# EAGLE design 14226^6 (EAGLE 7.6.0)
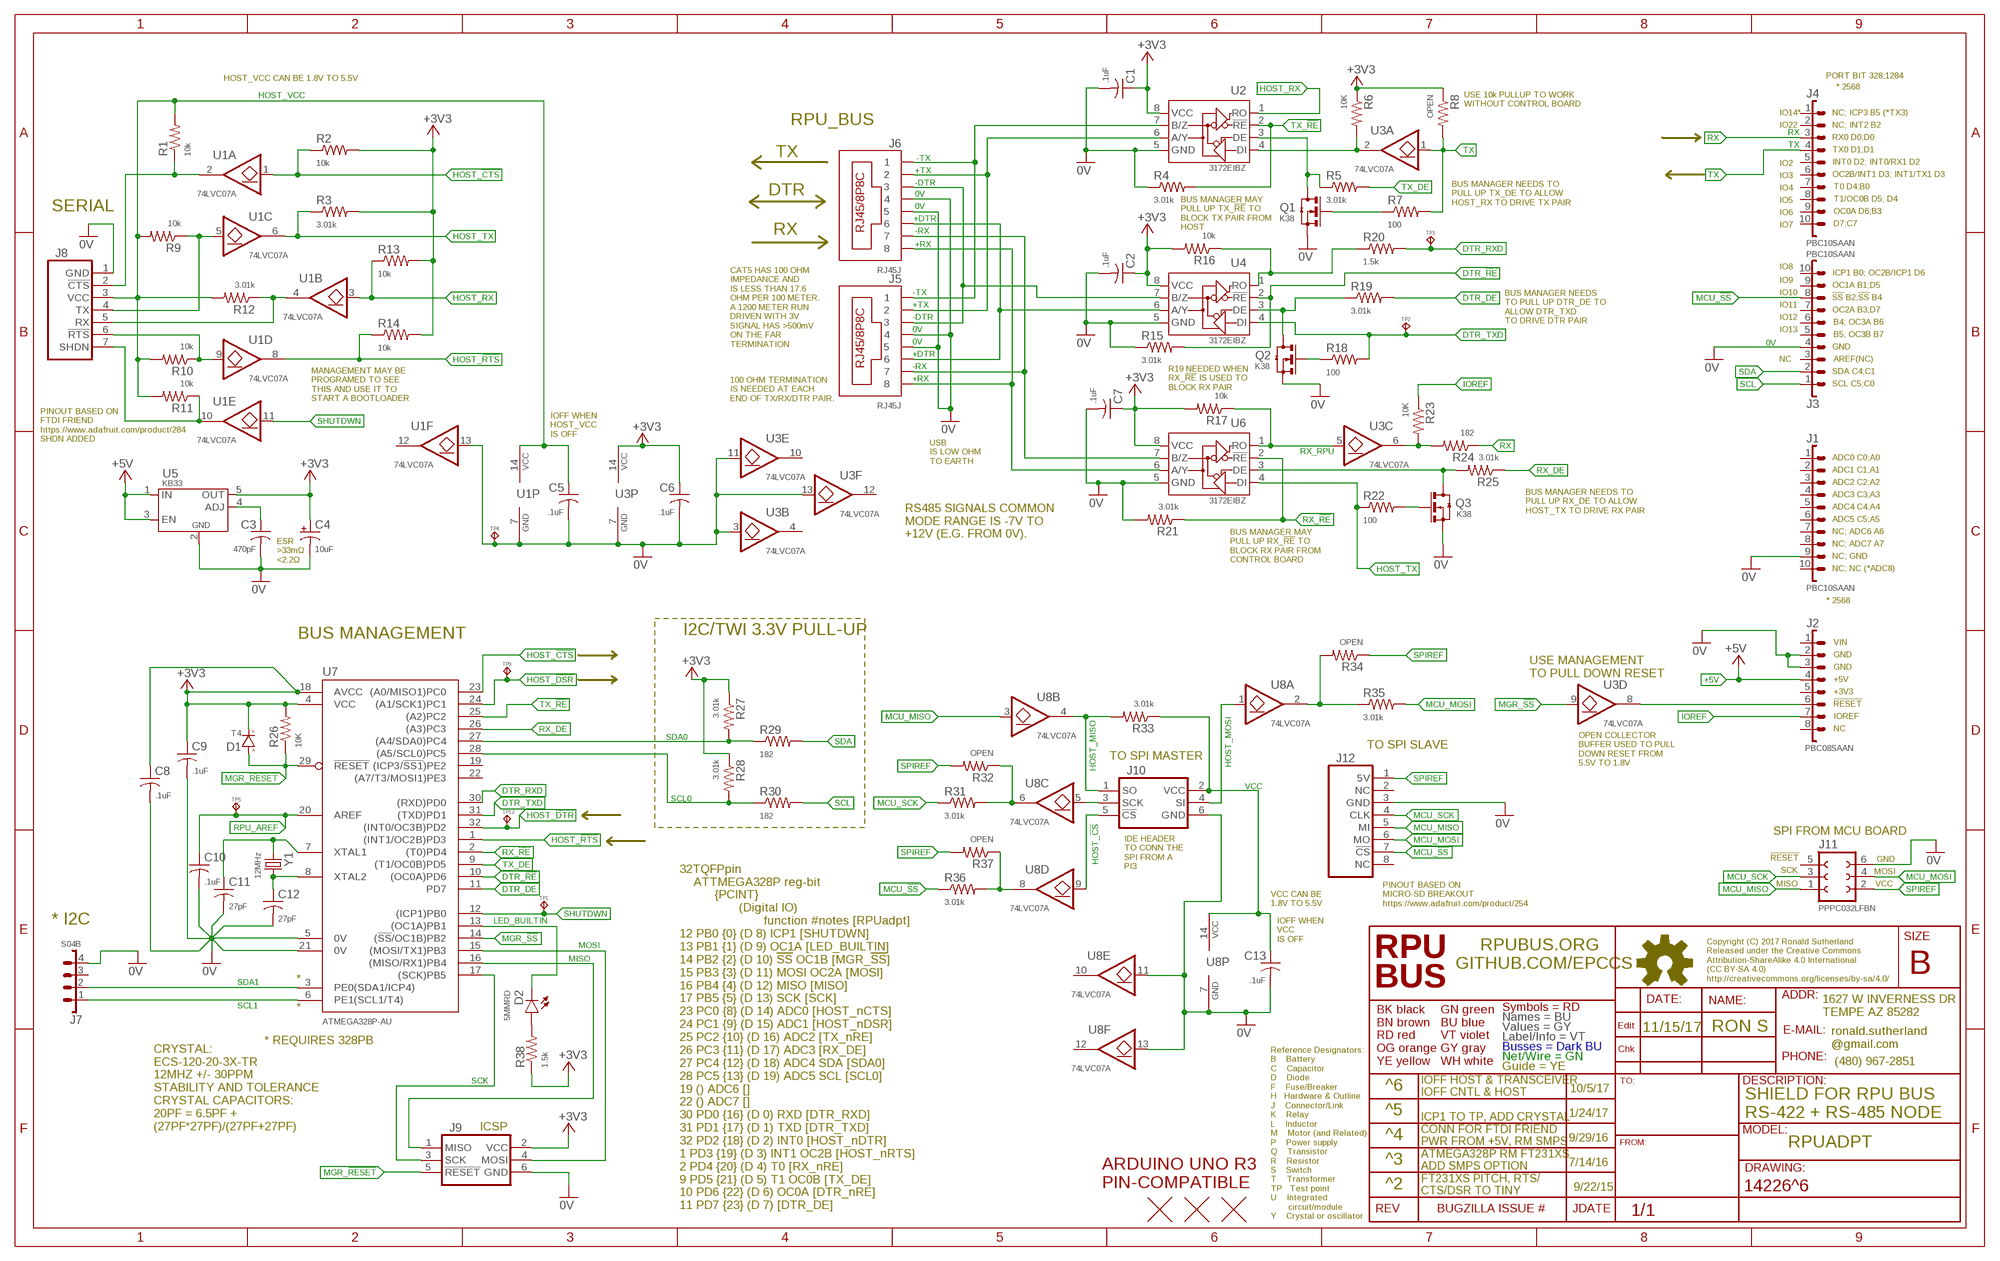
[diagram p0: schematic, sheet 1]

## Parts
C1  .1uF  CC0603A  [C0603(1608)]
C2  .1uF  CC0603A  [C0603(1608)]
C3  470pF  CC0603A  [C0603(1608)]
C4  10uF  CT1206  [3216]
C5  .1uF  CC0603A  [C0603(1608)]
C6  .1uF  CC0603A  [C0603(1608)]
C7  .1uF  CC0603A  [C0603(1608)]
C8  .1uF  CC0603A  [C0603(1608)]
C9  .1uF  CC0603A  [C0603(1608)]
C10  .1uF  CC0603A  [C0603(1608)]
C11  27pF  CC0603A  [C0603(1608)]
C12  27pF  CC0603A  [C0603(1608)]
C13  .1uF  CC0603A  [C0603(1608)]
D1  T4  DSOD123  [SOD123]
D2  5MMRD  LED5MM  [LED5MM]
J1  PBC10SAAN  1X10"  [1X10]
J2  PBC08SAAN  1X8"  [1X8]
J3  PBC10SAAN  1X10"  [1X10]
J4  PBC10SAAN  1X10"  [1X10]
J5  RJ45J  RJ45-8HZT  [RJ45-8HZT]
J6  RJ45J  RJ45-8HZT  [RJ45-8HZT]
J7  S04B  B04B  [B04B]
J8  FTDI-FRIEND  [FTDI-FRIEND]
J9  ISP-SPIPTH  [ISP]
J10  SPI  [ISP]
J11  PPPC032LFBN  F2X3  [F2X3]
J12  MICRO-SD  [MICRO-SD]
Q1  K38  N-CHSOT23  [SOT23]
Q2  K38  N-CHSOT23  [SOT23]
Q3  K38  N-CHSOT23  [SOT23]
R1  10k  R0805  [C0805(2012)]
R2  10k  R0805  [C0805(2012)]
R3  3.01k  R0805  [C0805(2012)]
R4  3.01k  R0805  [C0805(2012)]
R5  3.01k  R0805  [C0805(2012)]
R6  10K  R0805  [C0805(2012)]
R7  100  R0805  [C0805(2012)]
R8  OPEN  R0805  [C0805(2012)]
R9  10k  R0805  [C0805(2012)]
R10  10k  R0805  [C0805(2012)]
R11  10k  R0805  [C0805(2012)]
R12  3.01k  R0805  [C0805(2012)]
R13  10k  R0805  [C0805(2012)]
R14  10k  R0805  [C0805(2012)]
R15  3.01k  R0805  [C0805(2012)]
R16  10k  R0805  [C0805(2012)]
R17  10k  R0805  [C0805(2012)]
R18  100  R0805  [C0805(2012)]
R19  3.01k  R0805  [C0805(2012)]
R20  1.5k  R0805  [C0805(2012)]
R21  3.01k  R0805  [C0805(2012)]
R22  100  R0805  [C0805(2012)]
R23  10K  R0805  [C0805(2012)]
R24  182  R0805  [C0805(2012)]
R25  3.01k  R0805  [C0805(2012)]
R26  10K  R0805  [C0805(2012)]
R27  3.01k  R0805  [C0805(2012)]
R28  3.01k  R0805  [C0805(2012)]
R29  182  R0805  [C0805(2012)]
R30  182  R0805  [C0805(2012)]
R31  3.01k  R0805  [C0805(2012)]
R32  OPEN  R0805  [C0805(2012)]
R33  3.01k  R0805  [C0805(2012)]
R34  OPEN  R0805  [C0805(2012)]
R35  3.01k  R0805  [C0805(2012)]
R36  3.01k  R0805  [C0805(2012)]
R37  OPEN  R0805  [C0805(2012)]
R38  1.5k  R0805  [C0805(2012)]
TP1  TPPAD1-08  [P1-08]
TP2  TPPAD1-08  [P1-08]
TP3  TPPAD1-08  [P1-08]
TP4  TPPAD1-08  [P1-08]
TP5  TPPAD1-08  [P1-08]
TP9  TPPAD1-08  [P1-08]
TP12  TPPAD1-08  [P1-08]
U1  74LVC07A  7407D  [14SOIC]
U2  3172EIBZ  ISL3172EIBZ  [SOIC8]
U3  74LVC07A  7407D  [14SOIC]
U4  3172EIBZ  ISL3172EIBZ  [SOIC8]
U5  KB33  MIC5205  [SOT23-5,SOT25]
U6  3172EIBZ  ISL3172EIBZ  [SOIC8]
U7  ATMEGA328P-AU  ATMEGA328PB-AU  [TQFP32-08]
U8  74LVC07A  7407D  [14SOIC]
U$1  ARDUINO-UNO  [ARDUINO_UNO]
U$2  FIDUCIAL1.27  [FIDUCIAL-1.27]
U$3  FIDUCIAL1.27  [FIDUCIAL-1.27]
U$4  FIDUCIAL1.27  [FIDUCIAL-1.27]
Y1  12MHz  CSM-3X  [CSM-3X]

## Nets
0V: C1.2 C2.2 C3.2 C4.- C5.2 C6.2 C7.2 C8.2 C9.2 C10.2 C11.2 C12.2 C13.2 J1.9 J2.2 J2.3 J3.4 J5.4 J5.5 J6.4 J6.5 J7.4 J8.1(GND) J9.6(GND) J10.6(GND) J11.6 J12.3(GND) Q1.2(S)(S) Q2.2(S)(S) Q3.2(S)(S) R4.1 R15.1 R21.2 TP4.TP U1.7(P:GND) U1.13(F:I) U2.5(GND) U3.3(B:I) U3.7(P:GND) U3.11(E:I) U3.13(F:I) U4.5(GND) U5.2(GND) U6.5(GND) U7.5(0V) U7.21(0V) U8.7(P:GND) U8.11(E:I) U8.13(F:I)
+3V3: C1.1 C2.1 C4.+ C6.1 C7.1 C8.1 C9.1 D1.C(K) J9.2(VCC) R2.2 R3.2 R6.1 R8.1 R13.2 R14.2 R16.2 R17.2 R26.2 R27.1 R28.1 R38.1 U2.8(VCC) U3.14(P:VCC) U4.8(VCC) U5.5(OUT) U6.8(VCC) U7.4(VCC) U7.18(AVCC)
+5V: J2.4 U5.1(IN) U5.3(EN)
+DTR: J5.6 J6.6 U4.6(A/Y)
+RX: J5.8 J6.8 U6.6(A/Y)
+TX: J5.2 J6.2 U2.6(A/Y)
-DTR: J5.3 J6.3 U4.7(B/Z)
-RX: J5.7 J6.7 U6.7(B/Z)
-TX: J5.1 J6.1 U2.7(B/Z)
_HOST_!CTS: J8.2(!CTS) R1.1 U1.2(A:O)
_HOST_!RTS: J8.6(!RTS) R10.1 U1.9(D:I)
_HOST_RX: J8.5(RX) R12.1 U1.4(B:O)
_HOST_SHDN: J8.7(SHDN) R11.1 U1.10(E:O)
_HOST_TX: J8.4(TX) R9.1 U1.5(C:I)
DTR_!RE: R15.2 U4.2(!RE) U7.10((OC0A)PD6)
DTR_DE: R19.2 U7.11(PD7)
DTR_RXD: R20.2 TP3.TP U7.30((RXD)PD0)
DTR_TXD: R18.2 TP2.TP U4.4(DI) U7.31((TXD)PD1)
HOST_!CS: J10.5(!CS) U8.9(D:I)
HOST_!CTS: R2.1 U1.1(A:I) U7.23((A0/MISO1)PC0)
HOST_!DSR: TP9.TP U7.24((A1/SCK1)PC1)
HOST_!DTR: TP12.TP U7.32((INT0/OC3B)PD2)
HOST_!RTS: R14.1 U1.8(D:O) U7.1((INT1/OC2B)PD3)
HOST_MISO: J10.1(SO) R33.2 U8.4(B:O)
HOST_MOSI: J10.4(SI) U8.1(A:I)
HOST_RX: R13.1 U1.3(B:I) U2.1(RO)
HOST_SCK: J10.3(SCK) U8.5(C:I)
HOST_TX: R3.1 R22.1 U1.6(C:O) U6.4(DI)
HOST_VCC: C5.1 J8.3(VCC) R1.2 R9.2 R10.2 R11.2 R12.2 U1.14(P:VCC)
IOREF: J2.7 R23.1
LED_BUILTIN: D2.K U7.13((OC1A)PB1)
MCU_!SS!: J3.8 J12.7(!CS) R36.1
MCU_MISO: J11.1 J12.5(MI) U8.3(B:I)
MCU_MOSI: J11.4 J12.6(MO) R35.2
MCU_SCK: J11.3 J12.4(CLK) R31.1
MGR_!RESET: D1.A J9.5(!RESET) R26.1 U7.29(!RESET)
MGR_!SS!: U3.9(D:I) U7.14((!SS!/OC1B)PB2)
MISO: J9.1(MISO) U7.16((MISO/RX1)PB4)
MOSI: J9.4(MOSI) U7.15((MOSI/TX1)PB3)
N$3: J2.6 U3.8(D:O)
N$6: R34.2 R35.1 U8.2(A:O)
N$7: D2.A R38.2
N$8: R31.2 R32.1 U8.6(C:O)
N$10: R23.2 R24.2 U3.6(C:O)
N$11: Q3.3(D)(D) R25.2 U6.3(DE)
N$12: R36.2 R37.1 U8.8(D:O)
N$15: Q1.1(G)(G) R7.1
N$18: Q1.3(D)(D) R5.1 U2.3(DE)
N$19: R16.1 R20.1 U4.1(RO)
N$20: Q2.3(D)(D) R19.1 U4.3(DE)
N$22: Q2.1(G)(G) R18.1
N$24: C3.1 U5.4(ADJ)
N$25: Q3.1(G)(G) R22.2
RPU_AREF: C10.1 TP5.TP U7.20(AREF)
RX: J4.3 R24.1
RX_!RE: R21.1 U6.2(!RE) U7.2((T0)PD4)
RX_DE: R25.1 U7.26((A3)PC3)
RX_RPU: R17.1 U3.5(C:I) U6.1(RO)
SCK: J9.3(SCK) U7.17((SCK)PB5)
SCL: J3.1 R30.2
SCL0: R28.2 R30.1 U7.28((A5/SCL0)PC5)
SCL1: J7.1 U7.6(PE1(SCL1/T4))
SDA: J3.2 R29.2
SDA0: R27.2 R29.1 U7.27((A4/SDA0)PC4)
SDA1: J7.2 U7.3(PE0(SDA1/ICP4))
SHUTDWN: TP1.TP U1.11(E:I) U7.12((ICP1)PB0)
SPIREF: J11.2 J12.1(5V) R32.2 R34.1 R37.2
TX: J4.4 R7.2 R8.2 U3.1(A:I)
TX_!RE: R4.2 U2.2(!RE) U7.25((A2)PC2)
TX_DE: R5.2 U7.9((T1/OC0B)PD5)
TX_RPU: R6.2 U2.4(DI) U3.2(A:O)
VCC: C13.1 J10.2(VCC) R33.1 U8.14(P:VCC)
XTAL1: C11.1 U7.7(XTAL1) Y1.1
XTAL2: C12.1 U7.8(XTAL2) Y1.2
Unconnected: J1.1 J1.2 J1.3 J1.4 J1.5 J1.6 J1.7 J1.8 J1.10 J2.1 J2.5 J2.8 J3.3 J3.5 J3.6 J3.7 J3.9 J3.10 J4.1 J4.2 J4.5 J4.6 J4.7 J4.8 J4.9 J4.10 J7.3 J11.5 J12.2(NC) J12.8(NC) U1.12(F:O) U3.4(B:O) U3.10(E:O) U3.12(F:O) U7.19((ICP3/!SS1!)PE2) U7.22((A7/T3/MOSI1)PE3) U8.10(E:O) U8.12(F:O)

## Notes on the sheet
- PORT BIT 328;1284
- HOST_VCC CAN BE 1.8V TO 5.5V
- * 2568
- USE 10k PULLUP TO WORK
  WITHOUT CONTROL BOARD
- IO14* | NC; ICP3 B5 (*TX3)
- RPU_BUS | IO22 | NC; INT2 B2
- RX0 D0;D0
- TX0 D1;D1
- TX
- IO2 | INT0 D2; INT0/RX1 D2
- IO3 | OC2B/INT1 D3; INT1/TX1 D3
- IO4 | T0 D4;B0
- DTR
- IO5 | T1/OC0B D5; D4
- BUS MANAGER NEEDS TO
  PULL UP TX_DE TO ALLOW 
  HOST_RX TO DRIVE TX PAIR
- SERIAL
- IO6 | OC0A D6;B3
- IO7 | D7;C7
- BUS MANAGER MAY
  PULL UP TX_!RE! TO
  BLOCK TX PAIR FROM
  HOST
- RX
- IO8
- ICP1 B0; OC2B/ICP1 D6
- IO9
- OC1A B1;D5
- IO10
- !SS! B2;!SS! B4
- IO11
- OC2A B3;D7
- IO12
- BUS MANAGER NEEDS
  TO PULL UP DTR_DE TO
  ALLOW DTR_TXD
  TO DRIVE DTR PAIR
- B4; OC3A B6
- IO13
- B5; OC3B B7
- CAT5 HAS 100 OHM 
  IMPEDANCE AND 
  IS LESS THAN 17.6 
  OHM PER 100 METER. 
  A 1200 METER RUN
  DRIVEN WITH 3V 
  SIGNAL HAS >500mV
  ON THE FAR
  TERMINATION
- GND
- NC | AREF(NC)
- SDA C4;C1
- SCL C5;C0
- R19 NEEDED WHEN
  RX_!RE! IS USED TO
  BLOCK RX PAIR
- MANAGEMENT MAY BE
  PROGRAMED TO SEE
  THIS AND USE IT TO 
  START A BOOTLOADER
- 100 OHM TERMINATION
  IS NEEDED AT EACH
  END OF TX/RX/DTR PAIR.
- IOFF WHEN
  HOST_VCC 
  IS OFF
- PINOUT BASED ON
  FTDI FRIEND
  https://www.adafruit.com/product/284
  SHDN ADDED
- ADC0 C0;A0
- USB
  IS LOW OHM
  TO EARTH
- ADC1 C1;A1
- ADC2 C2;A2
- ADC3 C3;A3
- ADC4 C4;A4
- BUS MANAGER NEEDS TO 
  PULL UP RX_DE TO ALLOW 
  HOST_TX TO DRIVE RX PAIR
- ADC5 C5;A5
- NC; ADC6 A6
- RS485 SIGNALS COMMON 
  MODE RANGE IS -7V TO 
  +12V (E.G. FROM 0V).
- NC; ADC7 A7
- NC; GND
- ESR
  >33mΩ
  <2.2Ω
- BUS MANAGER MAY
  PULL UP RX_!RE! TO 
  BLOCK RX PAIR FROM 
  CONTROL BOARD
- NC; NC (*ADC8)
- * 2568
- BUS MANAGEMENT | I2C/TWI 3.3V PULL-UP
- VIN
- GND
- GND
- USE MANAGEMENT
  TO PULL DOWN RESET
- +5V
- +3V3
- !RESET
- IOREF
- NC
- TO SPI SLAVE
- TO SPI MASTER
- OPEN COLLECTOR 
  BUFFER USED TO PULL 
  DOWN RESET FROM 
  5.5V TO 1.8V
- SPI FROM MCU BOARD
- !RESET
- GND
- SCK
- IDE HEADER
  TO CONN THE
  SPI FROM A 
  PI3
- MOSI
- MISO
- VCC
- VCC CAN BE 
  1.8V TO 5.5V
- PINOUT BASED ON
  MICRO-SD BREAKOUT
  https://www.adafruit.com/product/254
- * I2C
- IOFF WHEN
  VCC 
  IS OFF
- *
- *
- 11/15/17 | RON S
- * REQUIRES 328PB
- ^6 | 10/5/17
- IOFF HOST & TRANSCEIVER
  IOFF CNTL & HOST
- ^5 | 1/24/17
- SHIELD FOR RPU BUS
  RS-422 + RS-485 NODE
- ICP1 TO TP, ADD CRYSTAL
- CRYSTAL:
  ECS-120-20-3X-TR
  12MHZ +/- 30PPM
  STABILITY AND TOLERANCE
  CRYSTAL CAPACITORS:
  20PF = 6.5PF +
  (27PF*27PF)/(27PF+27PF)
- ICSP
- ^4 | 9/29/16
- CONN FOR FTDI FRIEND
  PWR FROM +5V, RM SMPS
- RPUADPT
- ^3 | 7/14/16
- ATMEGA328P RM FT231XS
  ADD SMPS OPTION
- ^2 | 9/22/15
- FT231XS PITCH, RTS/
  CTS/DSR TO TINY
- 32TQFPpin
      ATTMEGA328P reg-bit
            {PCINT}
                   (Digital IO)
                          function #notes [RPUadpt]
  12 PB0 {0} (D 8) ICP1 [SHUTDWN]
  13 PB1 {1} (D 9) OC1A [LED_BUILTIN]
  14 PB2 {2} (D 10) !SS! OC1B [MGR_!SS!]
  15 PB3 {3} (D 11) MOSI OC2A [MOSI]
  16 PB4 {4} (D 12) MISO [MISO]
  17 PB5 {5} (D 13) SCK [SCK]
  23 PC0 {8} (D 14) ADC0 [HOST_nCTS]
  24 PC1 {9} (D 15) ADC1 [HOST_nDSR]
  25 PC2 {10} (D 16) ADC2 [TX_nRE]
  26 PC3 {11} (D 17) ADC3 [RX_DE]
  27 PC4 {12} (D 18) ADC4 SDA [SDA0]
  28 PC5 {13} (D 19) ADC5 SCL [SCL0]
  19 () ADC6 []
  22 () ADC7 []
  30 PD0 {16} (D 0) RXD [DTR_RXD]
  31 PD1 {17} (D 1) TXD [DTR_TXD]
  32 PD2 {18} (D 2) INT0 [HOST_nDTR]
  1 PD3 {19} (D 3) INT1 OC2B [HOST_nRTS]
  2 PD4 {20} (D 4) T0 [RX_nRE]
  9 PD5 {21} (D 5) T1 OC0B [TX_DE]
  10 PD6 {22} (D 6) OC0A [DTR_nRE]
  11 PD7 {23} (D 7) [DTR_DE]

## Library data of the parts
C1-C3 C5-C13 = C-C:C: CAPACITOR Symbol
C4 = C-T:CT: Tantalum Electrolytic Capacitor
D1 = D-GP:D: DIODE
D2 = D-LED:LED: LED 120120WH [CREE,XHGAWT-00-0000-00000HXE1] LED WHITE 6500K 150LUM-W120120
J1 J3 J4 = J-HDR2.54mm:1X10: 10 POS HEADER PBC10S [SULLINS,PBC10SAAN]HEADER MALE BRKWAY 10POS .1IN AA
J2 = J-HDR2.54mm:1X8: 8 POS HEADER PBC08SAAN [SULLINS,PBC08SAAN]HEADER MALE BRKWAY 8POS .1IN AA
J5 J6 = J-RJ45:RJ45-8: RJ45 Jack RJ45J [ASSMANN,A-2014-2-4-R] JACK MODULAR VERT PCB 8P8C UNSHIELD Horz version form sparkfun sku PRT-00643, and breakout board sku is BOB-00716.
J7 = J-HDR2mm:B04B: B04B [JST@B04B-PASK] CONN HEADER VERT THRU 4POS S04B [JST@S04B-PASK] CONN HEADER SIDE THRU 4POS
J8 = U-AVR:FTDI-FRIEND: used for serial interfaces and serial bootloaders optiboot does not read the fuse but reports as they should be. It also erases chip. avrdude -c arduino -v -p atmega328p -P /dev/ttyUSB0 -b 115200 -U flash:w:BlinkLED.hex xboot use -e to erase chip, and -u to disable fuse checks since bootloaders can't see them. avrdude -c avr109 -v -p atmega1284p -P /dev/ttyUSB0 -b 115200 -e -u -U flash:w:BlinkLED.hex Arduino uses the nRTS (or nDTR) negative going edge to start the bootloader by causing a reset on the MCU.
J9 = U-AVR:ISP-SPI: AVR ISP thru SPI In-System Programming uses the target Atmel AVR’s internal SPI (Serial Peripheral Interface) to download code into the flash and EEPROM memories. It is not a debugging interface. When designing an application PCB which includes an AVR with the SPI interface, this pinout should be used. Sparkfun SKU: BOB-08508
J10 = U-AVR:SPI: SPI slave interface
J11 = J-HDR2.54mm:F2X3: FEMALE HEADER 2X3POS
J12 = U-AVR:MICRO-SD: MicroSD card breakout PINOUT BASED ON https://www.adafruit.com/product/254 used to interface SPI master controller to SPI slave device (e.g. an SD card)
Q1-Q3 = Q-NCH:N-CH?*: ENHANCEMENT MODE MOSFET SOT23 is BSS138 pinout
R1-R38 = R-C:R: Resiistor American-style symbol
TP1-TP5 TP9 TP12 = J-TP:TP: Test pad
U1 U3 U8 = U-7400:74*07: HEX BUFFER, OPEN DRAIN/COLLECTOR 74LVC07A [DIODES,74LVC07AS14-13] LOGIC BUFFER OPEN DRAIN 14SOIC
U2 U4 U6 = U-Transceiver:ISL3172E: TRANSCEIVER RS485 3.3V HALFDPLX
U5 = P-DCDC:MIC5205: KB33 [MICREL,MIC5205-3.3YM5] REG ULDO 3V3 150MA SOT23-5
U7 = U-AVR:ATMEGA328PB-AU: ATmega328PB 4 Kbytes FLASH 128 bytes SRAM 256 bytes EEPROM 2 UART, 2 I2C, 2 SPI 8-channel 10 bit ADC
U$1 = J-BoardHDR:ARDUINO-UNO: Board Outline with holes and silk note the board dim layer is not defined
U$2-U$4 = H-Fiducial:FIDUCIAL: Fiducial Alignment Points Various fiducial points for machine vision alignment.
Y1 = Y-XTL:CSM: 16MHZ20 [ECS,ECS-160-20-3X-TR] CRYSTAL 16MHZ 20PF 30PPM CSM-3X

## Net classes
0 default: width 0.203 mm, drill 0.33 mm

## Board
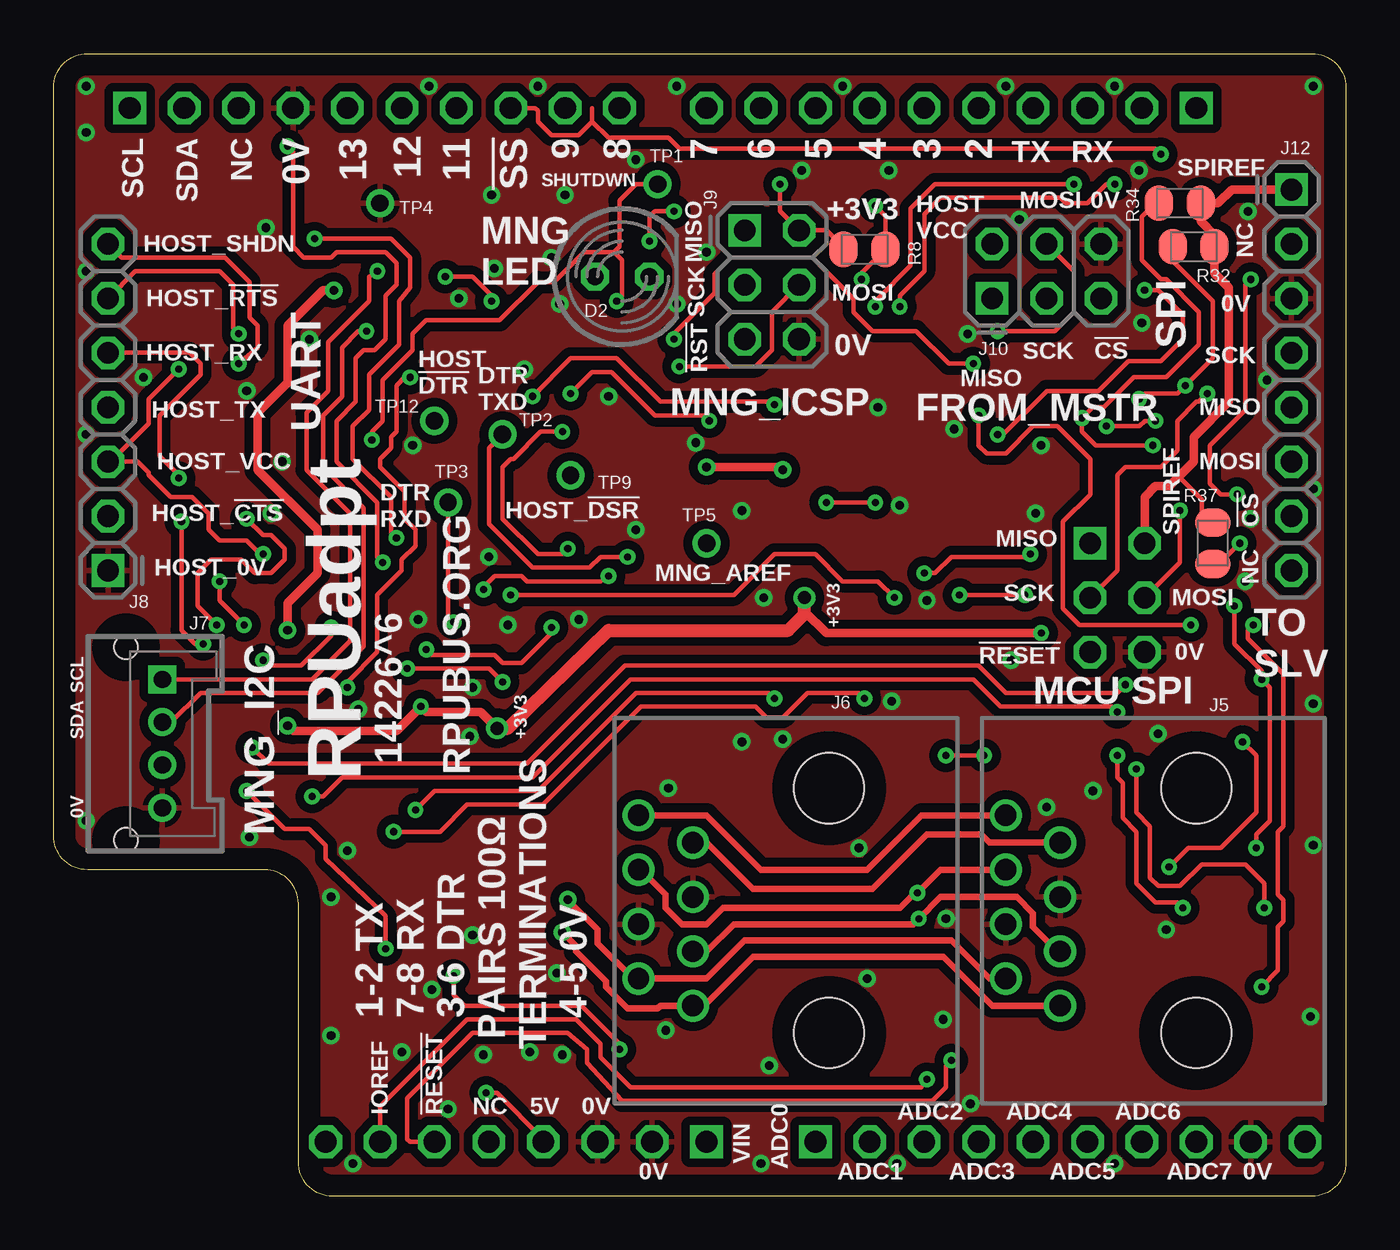
[diagram p1: board, top side]
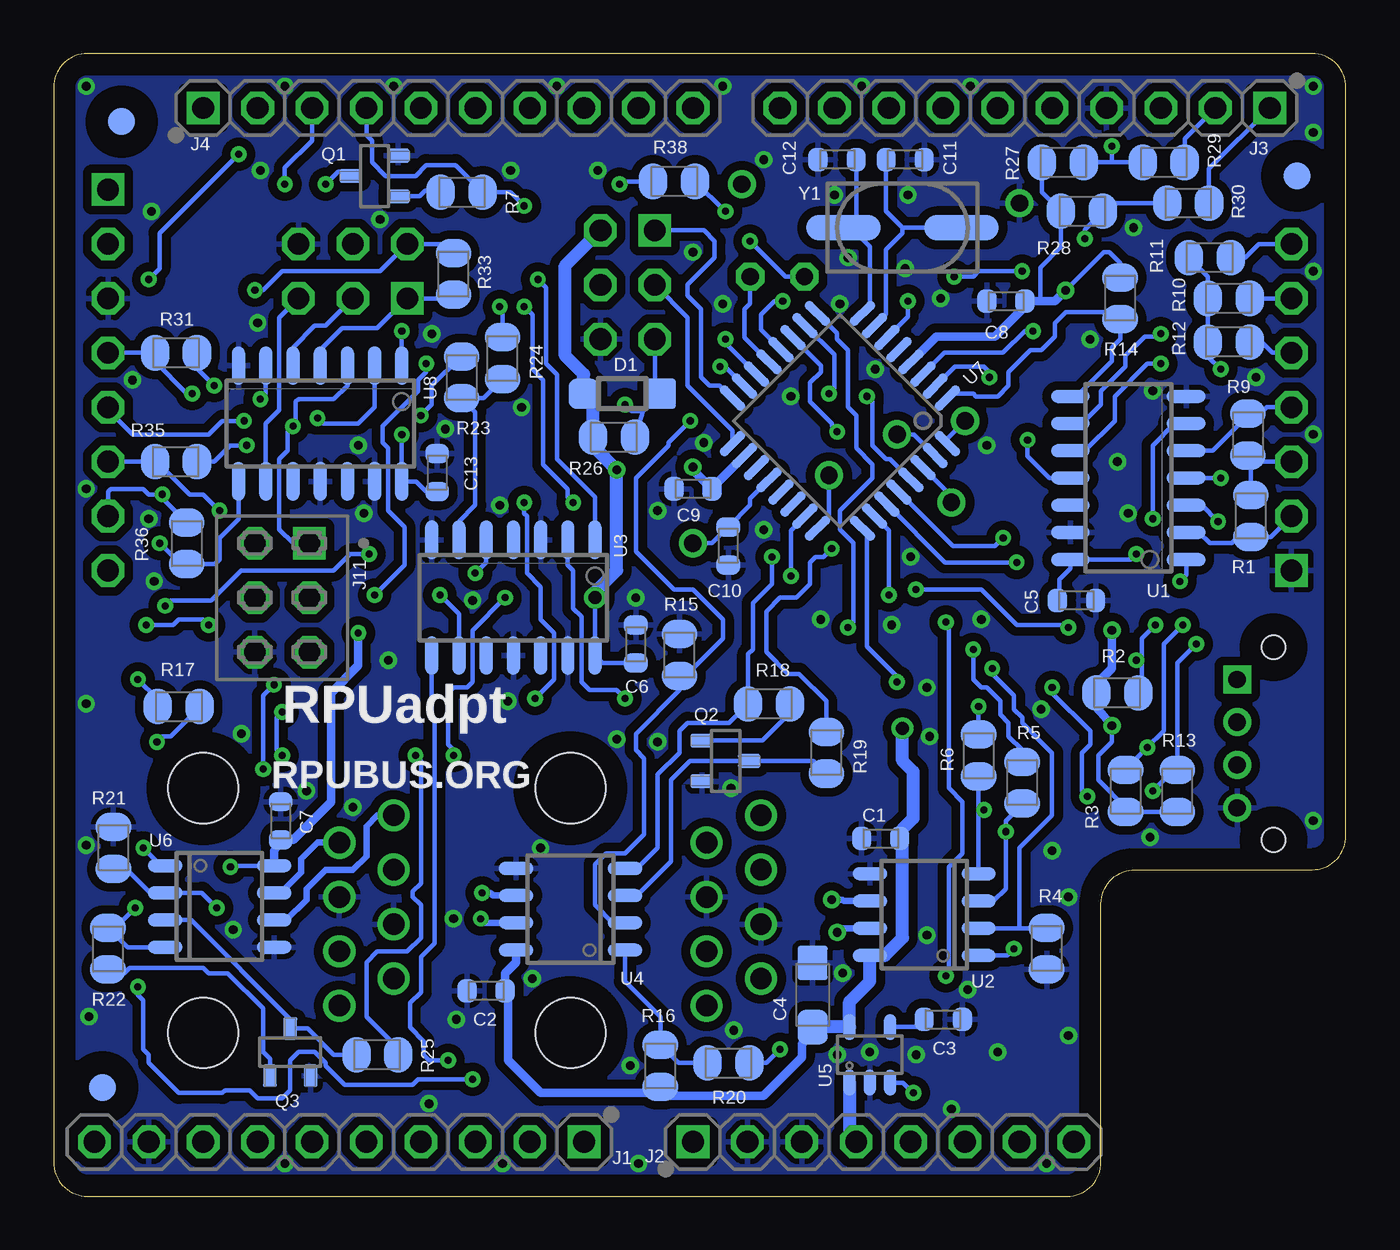
[diagram p2: board, bottom side, seen from below]

Size 60.33 x 53.34 mm. Coordinates in mm from the lower left corner, seen from the top.
Outline: 60.33,51.75 60.33,1.59 arc-90 58.74,0 13.02,0 arc-90 11.43,1.59 11.43,13.65 arc90 9.84,15.24 1.59,15.24 arc-90 0,16.83 0,51.75 arc-90 1.59,53.34 58.74,53.34 arc-90 60.33,51.75
Copper layers (1*16): Top 0.034290625mm / dielectric 60mil / Bottom 0.034290625mm
Design rules "default *": minimum track width 8mil, minimum drill 13mil, track to track 8mil, track to pad 8mil, pad to pad 8mil, via to via 8mil, smd to smd 8mil, copper to edge 40mil, drill to drill 12mil, minimum pad ring 10mil, minimum via ring 8mil, stop-mask expansion 4mil, vias tented up to drill 17mil, thermal gap 10mil

### Footprints (pad centres in the part's own frame; a part is rotated, then mirrored left to right if it is on the bottom)
C0603(1608) = smd 0.898 x 1.1: 1 -0.889,0; 2 0.889,0
3216 = smd 1.6 x 1.4: + -1.5,0; - 1.5,0
SOD123 = smd 1.4 x 1.4: A 1.8,0; C -1.8,0
LED5MM = drill 0.813 octagon: A -1.27,0; K 1.27,0
1X10 = drill 1.016 square: 1 0,0 | drill 1.016 octagon: 2 2.54,0; 3 5.08,0; 4 7.62,0; 5 10.16,0; 6 12.7,0; 7 15.24,0; 8 17.78,0; 9 20.32,0; 10 22.86,0
1X8 = drill 1.016 square: 1 0,0 | drill 1.016 octagon: 2 2.54,0; 3 5.08,0; 4 7.62,0; 5 10.16,0; 6 12.7,0; 7 15.24,0; 8 17.78,0
RJ45-8HZT = drill 1: 1 -4.445,6.35; 2 -3.175,8.89; 3 -1.905,6.35; 4 -0.635,8.89; 5 0.635,6.35; 6 1.905,8.89; 7 3.175,6.35; 8 4.445,8.89 | hole 3.264: -5.715,0; 5.715,0
B04B = drill 0.8 square: 1 0,0 | drill 0.8: 2 2,0; 3 4,0; 4 6,0 | hole 1.1: 7.5,-1.7; -1.5,-1.7
FTDI-FRIEND = drill 1.016 square: 1 0,0 | drill 1.016 octagon: 2 2.54,0; 3 5.08,0; 4 7.62,0; 5 10.16,0; 6 12.7,0; 7 15.24,0
ISP = drill 1.016 square: 1 0,0 | drill 1.016 octagon: 2 0,2.54; 3 2.54,0; 4 2.54,2.54; 5 5.08,0; 6 5.08,2.54
F2X3 = drill 1.016 square: 1 0,0 | drill 1.016 octagon: 2 0,-2.54; 3 2.54,0; 4 2.54,-2.54; 5 5.08,0; 6 5.08,-2.54
MICRO-SD = drill 1.016 square: 1 0,0 | drill 1.016 octagon: 2 2.54,0; 3 5.08,0; 4 7.62,0; 5 10.16,0; 6 12.7,0; 7 15.24,0; 8 17.78,0
SOT23 = smd 0.65 x 1.06: 1(G) -0.95,-1.1; 2(S) 0.95,-1.1; 3(D) 0,1.1
C0805(2012) = smd 1.321 x 1.651: 1 -0.977,0; 2 0.977,0
P1-08 = drill 0.813: TP 0,0
14SOIC = smd 0.6 x 1.8: 1 -3.81,-2.7; 2 -2.54,-2.7; 3 -1.27,-2.7; 4 0,-2.7; 5 1.27,-2.7; 6 2.54,-2.7; 7 3.81,-2.7; 8 3.81,2.7; 9 2.54,2.7; 10 1.27,2.7; 11 0,2.7; 12 -1.27,2.7; 13 -2.54,2.7; 14 -3.81,2.7
SOIC8 = smd 0.6 x 1.6: 1 -1.905,-2.54; 2 -0.635,-2.54; 3 0.635,-2.54; 4 1.905,-2.54; 5 1.905,2.54; 6 0.635,2.54; 7 -0.635,2.54; 8 -1.905,2.54
SOT23-5,SOT25 = smd 0.55 x 1.2: 1 -0.95,-1.3; 2 0,-1.3; 3 0.95,-1.3; 4 0.95,1.3; 5 -0.95,1.3
TQFP32-08 = smd 1.5 x 0.45: 1 -4.293,2.8; 2 -4.293,2; 3 -4.293,1.2; 4 -4.293,0.4; 5 -4.293,-0.4; 6 -4.293,-1.2; 7 -4.293,-2; 8 -4.293,-2.8; 17 4.293,-2.8; 18 4.293,-2; 19 4.293,-1.2; 20 4.293,-0.4; 21 4.293,0.4; 22 4.293,1.2; 23 4.293,2; 24 4.293,2.8 | smd 0.45 x 1.5: 9 -2.8,-4.293; 10 -2,-4.293; 11 -1.2,-4.293; 12 -0.4,-4.293; 13 0.4,-4.293; 14 1.2,-4.293; 15 2,-4.293; 16 2.8,-4.293; 25 2.8,4.293; 26 2,4.293; 27 1.2,4.293; 28 0.4,4.293; 29 -0.4,4.293; 30 -1.2,4.293; 31 -2,4.293; 32 -2.8,4.293
FIDUCIAL-1.27 = smd 1.27 x 1.27: 1 0,0
CSM-3X = smd 3.5 x 1.2: 1 -2.75,0; 2 2.75,0

### Placement (x,y rotation side)
C1  21.72,16.7 180 bottom
C2  40.13,9.59 180 bottom
C3  18.8,8.26 0 bottom
C4  24.89,9.4 90 bottom
C5  12.57,27.81 0 bottom
C6  33.15,25.78 90 bottom
C7  49.72,17.53 90 bottom
C8  15.88,41.78 180 bottom
C9  30.48,33.02 180 bottom
C10  28.83,30.35 270 bottom
C11  20.57,48.39 0 bottom
C12  23.75,48.39 180 bottom
C13  42.42,33.78 90 bottom
D1  33.78,37.47 0 bottom
D2  26.54,42.93 0 top
J1  35.56,2.54 180 bottom
J2  30.48,2.54 0 bottom
J3  3.56,50.8 180 bottom
J4  53.34,50.8 0 bottom
J5  53.34,13.34 90 top
J6  36.2,13.34 90 top
J7  5.08,24.13 270 top
J8  2.54,29.21 90 top
J9  32.26,45.09 270 top
J10  43.81,41.91 0 top
J11  48.39,30.48 270 bottom
J12  57.78,46.99 270 top
Q1  45.34,47.62 90 bottom
Q2  28.96,20.32 270 bottom
Q3  49.28,6.73 0 bottom
R1  4.45,31.75 90 bottom
R2  10.67,23.5 180 bottom
R3  10.29,18.92 270 bottom
R4  13.97,11.56 90 bottom
R5  15.11,19.3 90 bottom
R6  17.14,20.57 270 bottom
R7  41.27,46.86 0 bottom
R8  37.85,44.2 0 top
R9  4.57,35.56 270 bottom
R10  5.46,41.91 180 bottom
R11  6.35,43.81 180 bottom
R12  5.46,39.88 180 bottom
R13  7.87,18.92 270 bottom
R14  10.54,41.91 90 bottom
R15  31.11,25.27 270 bottom
R16  32,6.1 270 bottom
R17  54.48,22.86 0 bottom
R18  26.92,22.99 180 bottom
R19  24.26,20.7 90 bottom
R20  28.83,6.22 0 bottom
R21  57.53,16.26 90 bottom
R22  57.78,11.56 270 bottom
R23  41.27,38.23 270 bottom
R24  39.37,39.12 270 bottom
R25  45.21,6.6 180 bottom
R26  34.16,35.43 180 bottom
R27  13.21,48.26 0 bottom
R28  12.32,45.97 0 bottom
R29  8.51,48.26 0 bottom
R30  7.37,46.35 0 bottom
R31  54.61,39.37 0 bottom
R32  53.21,44.32 0 top
R33  41.66,43.05 270 bottom
R34  52.58,46.35 180 top
R35  54.61,34.29 180 bottom
R36  54.1,30.48 270 bottom
R37  54.1,30.48 90 top
R38  31.37,47.37 0 bottom
TP1  28.19,47.24 270 top
TP2  20.95,35.56 0 top
TP3  18.41,32.38 0 top
TP4  15.24,46.35 0 top
TP5  30.48,30.48 0 top
TP9  24.13,33.66 0 top
TP12  17.78,36.2 0 top
U1  10.16,33.53 90 bottom
U2  19.68,13.14 90 bottom
U3  38.86,27.94 180 bottom
U4  36.2,13.4 90 bottom
U5  22.23,6.6 0 bottom
U6  52.58,13.53 270 bottom
U7  23.62,36.2 225 bottom
U8  47.88,36.07 180 bottom
U$1  -15.24,0 0 top  (outside the outline)
U$2  57.15,50.16 0 bottom
U$3  2.29,47.62 0 bottom
U$4  58.04,5.08 0 bottom
Y1  20.7,45.21 180 bottom

### Tracks (layer width: path | path; a pad name or v marks a point on that pad's centre or on a via)
0V  (via drill 0.41)
  other vias: 33.4,6.1 4.19,38.23 10.16,31.88 10.67,34.29 9.02,37.59 18.92,41.91 20.57,43.31 23.24,43.81 23.88,46.74 20.45,46.74 21.97,38.61 25.91,37.34 37.97,10.16 41.53,8.26 42.8,4.32 39.37,1.52 33.02,1.52 12.95,7.49 19.56,12.19 28.57,7.75 13.97,1.52 18.41,4.06 12.95,13.97 9.14,16.76 13.72,16.13 19.43,21.46 19.56,23.75 24.51,26.92 33.15,27.94 40.77,27.81 42.04,35.81 38.48,36.83 39.5,32.26 32.13,32 29.97,35.18 20.32,29.84 27.18,31.11 21.21,26.67 17.02,26.92 16.76,35.05 14.22,22.73 34.04,21.34 37.59,16.26 41.66,12.95 48.51,18.92 51.56,21.59 58.8,16.38 58.67,8.38 49.53,1.52 51.94,12.45 23.5,10.41 1.52,17.53 1.52,35.56 1.52,43.18 1.52,51.82 1.52,49.66 9.91,45.21 34.92,47.88 23.62,41.66 38.99,47.88 50.67,47.88 50.8,40.77 45.85,31.88 46.1,35.05 56.64,38.1 58.8,33.02 55.63,28.7 58.8,22.99 44.7,25.02 39.12,23.11 46.35,18.16 32.13,21.21 22.23,6.73 20.07,6.6 23.75,6.6 17.65,9.65 16.26,6.73 28.7,19.05 29.08,41.66 30.48,44.07 11.94,40.01 42.67,40.26 45.09,45.59 27.18,48.39 55.88,31.62 55.75,45.97 58.8,51.82 49.53,51.82 44.45,51.82 36.83,51.82 29.08,51.82 22.61,51.82 17.53,51.82
  pour Top (isolate 0.406): 10.79,0 10.79,14.61 0,14.61 0,53.34 60.33,53.34 60.33,0
  pour Bottom (isolate 0.406): 0,53.34 60.33,53.34 60.33,0 10.79,0 10.79,14.61 0,14.61
+3V3  (via drill 0.33, 0.41, 0.61)
  Top 0.203: v52.07,15.37 52.96,16.26 54.48,16.26 56.13,17.91 56.13,20.57 v55.5,21.21 | R8.1 36.87,44.28 36.07,45.09 J9.2 33.91,45.97 v33.91,47.24
  Top 0.406: v13.08,42.29 12.57,42.29 10.92,40.64 10.92,37.97 9.53,36.58 9.53,33.91 12.32,31.11 12.32,29.08 10.92,27.69 v10.92,26.42 | v10.92,21.97 11.18,21.72 16,21.72 v17.14,22.86 17.4,22.61 19.94,22.61 v20.7,21.84 | v46.1,26.29 36.07,26.29 35.05,27.3 v35.05,27.94 | v34.04,33.91 33.91,34.04 v30.48,34.04
  Top 0.61: v20.7,21.84 21.21,21.84 25.91,26.42 34.29,26.42 35.05,27.18 v35.05,27.94
  Bottom 0.203: v52.07,15.37 51.94,15.37 51.88,15.43 U6.8 | R27.1 14.19,46.86 R28.1 13.3,44.32 14.26,43.36 14.26,41.78 | 7.58,17.95 R13.2 R3.2 10.29,18.16 11.56,19.43 11.56,20.57 10.92,21.21 v10.92,21.97 | R6.1 v17.14,22.86 | v35.05,27.94 U3.14 34.7,24.89 C6.1 | R17.2 53.51,22.82 54.86,21.46 55.24,21.46 v55.5,21.21 | R16.2 32,4.7 | R38.1 33.78,47.37 v33.91,47.24 | v13.08,42.29 11.3,44.07 11.05,44.07 10.54,43.56 R14.2
  Bottom 0.406: C4.+ 24.89,7.62 25.4,7.11 25.4,6.48 27.18,4.7 32,4.7 32.13,4.83 37.59,4.83 39.12,6.35 39.12,9.34 C2.1 39.24,10.41 38.73,10.92 U4.8 | U6.8 50.04,16.13 49.91,16.32 C7.1 49.15,16.64 47.37,18.41 47.37,23.5 46.1,24.77 v46.1,26.29 | v13.08,42.29 13.59,41.78 14.26,41.78 C8.1 15.11,41.4 16.38,40.13 19.12,40.13 U7.4 | v10.92,21.97 11.56,22.73 11.56,22.69 R2.2 11.64,23.91 10.92,24.64 v10.92,26.42 | U7.18 29.59,33.05 C9.1 30.48,33.91 v30.48,34.04
  Bottom 0.61: C4.+ U5.5 23.18,9.08 22.23,10.03 U2.8 21.53,11.24 20.7,12.06 20.7,16.57 | 20.7,16.57 20.7,17.14 20.19,17.65 20.19,19.81 20.7,20.32 v20.7,21.84 | v35.05,27.94 35.05,28.19 34.04,29.21 v34.04,33.91 35.05,34.92 35.05,35.39 R26.2 35.14,37.02 D1.C 35.58,38.38 36.45,39.24 36.45,43.43 J9.2 | 20.7,16.57 C1.1
+5V  (via drill 0.33)
  Top 0.203: v20.19,4.83 20.7,4.83 22.86,2.67 J2.4
  Bottom 0.203: U5.3 20.67,5.3 v20.19,4.83
  Bottom 0.61: U5.1 23.18,2.85 J2.4
+DTR  (via drill 0.33)
  Top 0.305: J6.6 27.43,15.24 28.57,14.1 28.57,13.46 29.34,12.7 30.48,12.7 31.24,13.46 39.5,13.46 40.2,14.16 v40.32,14.16 41.4,15.24 J5.6
  Bottom 0.305: U4.6 39.81,14.03 39.94,14.16 v40.32,14.16
+RX
  Top 0.305: J5.8 40.51,17.78 37.97,15.24 33.02,15.24 30.48,17.78 J6.8
  Bottom 0.305: U6.6 49.47,12.89 48.51,13.84 48.51,14.35 47.62,15.24 46.35,15.24 45.72,15.88 45.72,17.27 45.21,17.78 J5.8
+TX  (via drill 0.41)
  Top 0.305: J5.2 43.69,10.16 41.91,11.94 32.26,11.94 30.48,10.16 J6.2 27.05,10.16 25.4,11.81 25.4,12.45 v24,13.84
  Bottom 0.305: v24,13.84 23.5,13.84 23.43,13.78 U2.6
-DTR  (via drill 0.33)
  Top 0.305: J6.3 30.48,11.43 31.75,12.7 40.13,12.7 v40.39,12.95 41.4,13.97 44.96,13.97 45.72,13.21 45.72,12.57 46.86,11.43 J5.3
  Bottom 0.305: U4.7 40.2,12.76 v40.39,12.95
-RX
  Top 0.305: J6.7 30.48,16.51 32.64,14.35 38.23,14.35 40.77,16.89 43.31,16.89 43.69,16.51 J5.7
  Bottom 0.305: U6.7 49.72,14.16 48.77,15.11 48.77,15.75 48.01,16.51 J5.7
-TX  (via drill 0.41)
  Top 0.305: J5.1 43.81,8.89 41.53,11.18 32.64,11.18 30.35,8.89 J6.1 28.32,8.89 28.19,8.76 26.8,8.76 25.78,9.78 25.78,10.03 24.38,11.43 24.38,11.68 v23.75,12.32
  Bottom 0.305: U2.7 23.56,12.51 v23.75,12.32
_HOST_!CTS
  Bottom 0.203: U1.2 6.86,30.99 6.35,30.48 5.33,30.48 5.04,30.77 R1.1 3.52,30.77 J8.2
_HOST_!RTS  (via drill 0.33)
  Top 0.203: v8.64,40.26 8.38,40.51 8.38,42.55 7.75,43.18 3.81,43.18 J8.6
  Bottom 0.203: J8.6 R10.1 | U1.9 12.32,36.07 11.43,36.96 11.43,37.59 10.29,38.73 10.29,39.24 9.4,40.13 8.76,40.13 v8.64,40.26
_HOST_RX  (via drill 0.33)
  Top 0.203: v5.84,33.53 5.84,33.66 4.95,34.54 4.95,36.45 6.86,38.35 6.86,38.86 6.35,39.37 J8.5
  Bottom 0.203: J8.5 3.43,39.37 3.94,39.88 R12.1 | U1.4 v5.84,33.53
_HOST_SHDN  (via drill 0.33)
  Top 0.203: v8.64,38.86 9.53,39.62 9.53,40.64 9.14,41.02 9.14,42.67 8,43.81 3.17,43.81 J8.7
  Bottom 0.203: R11.1 4.7,43.81 4.06,44.45 J8.7 | U1.10 12.19,34.8 10.79,36.2 10.79,37.34 9.27,38.86 v8.64,38.86
_HOST_TX
  Bottom 0.203: U1.5 6.22,34.8 4.57,36.45 R9.1 3.98,36.54 3.68,36.83 J8.4
DTR_!RE  (via drill 0.33)
  Top 0.203: v24.13,37.47 25.15,38.48 26.04,38.48 28.07,36.45 30.35,36.45 v30.61,36.2
  Bottom 0.203: U4.2 34.23,12.76 35.05,13.59 35.05,15.49 34.54,16 33.66,16 32.77,16.89 32.77,20.45 33.15,20.83 33.15,21.59 31.11,23.62 R15.2 30.82,24.3 29.08,26.04 29.08,26.92 30.48,28.32 31.37,28.32 33.15,30.1 33.15,33.53 31.62,35.05 31.62,35.18 v30.61,36.2 | U7.10 23.88,39.28 23.88,37.72 v24.13,37.47
DTR_DE  (via drill 0.33)
  Top 0.203: v24,30.23 23.75,29.97 22.61,29.97 20.95,31.62 20.95,34.04 21.34,34.42 21.46,34.42 22.73,35.69 v23.75,35.69
  Bottom 0.203: R19.2 24.26,23.11 25.53,24.38 26.04,24.38 27.05,25.4 27.05,27.3 26.42,27.94 25.65,27.94 25.02,28.57 25.02,29.59 24.77,29.84 24.38,29.84 v24,30.23 | v23.75,35.69 24,35.94 24,36.07 25.02,37.08 25.02,37.97 24.51,38.48 24.51,38.78 U7.11
DTR_RXD  (via drill 0.33)
  Top 0.203: v26.42,6.86 26.42,7.11 24.64,8.89 19.18,8.89 18.67,9.4 v18.67,10.29 | v18.67,26.8 18.41,27.05 TP3.TP
  Bottom 0.203: v18.67,10.29 18.54,10.41 18.54,15.37 17.91,16 17.91,18.41 18.54,19.05 18.54,26.67 v18.67,26.8 | U7.30 18.41,32.69 TP3.TP | R20.2 27.05,6.22 v26.42,6.86
DTR_TXD  (via drill 0.33)
  Top 0.203: v26.8,29.84 25.53,29.84 25.02,29.34 22.35,29.34 20.32,31.37 20.32,34.92 TP2.TP
  Bottom 0.203: U4.4 33.08,15.3 32.13,16.26 32.13,19.68 31.11,20.7 31.11,21.72 30.73,22.1 28.79,22.1 R18.2 27.9,25.31 27.69,25.53 27.69,27.69 26.8,28.57 v26.8,29.84 | U7.31 20.16,35.56 TP2.TP
HOST_!CS
  Bottom 0.203: U8.9 50.42,36.07 49.78,36.7 49.78,41.02 J10.5
HOST_!CTS  (via drill 0.33)
  Top 0.203: v7.75,28.7 7.75,27.81 v8.89,26.67 | v9.78,25.02 10.03,24.77 11.56,24.77 12.95,26.16 v12.95,26.54 | v20.07,28.32 20.07,28.45 20.57,28.96 21.84,28.96 22.1,28.7 25.53,28.7 v25.91,28.96
  Bottom 0.203: U1.1 7.46,28.99 v7.75,28.7 | v8.89,26.67 9.53,26.04 9.53,25.02 | 9.53,25.02 9.53,23.66 R2.1 | v9.78,25.02 9.53,25.02 | v12.95,26.54 13.08,26.67 15.37,26.67 17.02,28.32 v20.07,28.32 | U7.23 25.91,31.08 v25.91,28.96
HOST_!DSR
  Bottom 0.203: U7.24 24.13,31.73 TP9.TP
HOST_!DTR
  Bottom 0.203: U7.32 18.61,35.37 TP12.TP
HOST_!RTS
  Bottom 0.203: U1.8 13.34,37.37 12.54,37.37 10.92,38.99 10.92,39.62 10.54,40.01 R14.1 10.88,41.27 13.08,41.27 13.59,40.77 13.59,40.13 14.22,39.5 14.73,39.5 15.75,38.48 15.75,37.85 16.26,37.34 17.27,37.34 17.4,37.47 18.39,37.47 U7.1
HOST_MISO
  Bottom 0.203: U8.4 47.88,39.5 46.86,40.51 45.21,40.51 J10.1 41.82,41.91 R33.2
HOST_MOSI  (via drill 0.33)
  Top 0.203: v44.07,40.39 46.74,40.39 47.62,41.27 47.62,43.18 J10.4
  Bottom 0.203: U8.1 v44.07,40.39
HOST_RX  (via drill 0.33)
  Top 0.203: v9.02,18.92 10.79,17.14 11.94,17.14 12.7,16.38 12.7,15.75 15.49,13.08 v15.49,11.56 | v5.97,31.5 5.97,26.42 6.6,25.78 v6.99,25.78
  Bottom 0.203: v9.02,18.92 8.04,19.9 R13.1 7.87,24.89 v6.99,25.78 | U1.3 6.73,32.26 v5.97,31.5 | U2.1 15.81,11.24 v15.49,11.56
HOST_SCK
  Bottom 0.203: U8.5 49.15,39.62 48.13,40.64 47.62,40.64 J10.3
HOST_TX  (via drill 0.33)
  Top 0.203: v9.27,20.95 10.03,20.19 22.1,20.19 26.67,24.77 43.18,24.77 44.45,23.5 49.66,23.5 v50.04,23.88 | v56.52,13.46 56.52,14.61 55.63,15.49 53.59,15.49 52.58,14.48 51.56,14.48 51.18,14.86 51.18,17.27 50.55,17.91 v50.55,19.94 | v7.62,26.67 6.73,27.56 6.73,29.08 7.37,29.72 8.76,29.72 9.4,29.08 10.16,29.08 10.79,29.72 10.79,30.23 10.16,30.86 9.78,30.86 v9.02,31.62
  Bottom 0.203: R3.1 9.31,20.92 | 9.31,20.92 8.51,21.72 8.51,25.78 v7.62,26.67 | 9.31,20.92 9.27,21.13 v9.27,20.95 | v50.55,19.94 50.55,23.37 v50.04,23.88 | U6.4 56.87,11.62 R22.1 57.44,12.53 v56.52,13.46 | v9.02,31.62 9.02,35.05 8,36.07 U1.6
HOST_VCC  (via drill 0.33)
  Top 0.203: v5.84,38.61 4.45,37.21 4.45,36.07 2.67,34.29 J8.3 3.94,34.29 4.45,33.78 4.45,33.66 5.46,32.64 6.48,32.64 7.24,31.88 7.24,31.11 7.75,30.61 9.02,30.61 9.65,29.97 v9.78,29.97
  Bottom 0.203: J8.3 4.28,34.29 R9.2 4.45,34.46 R1.2 | v5.84,38.61 6.44,39.2 R12.2 R10.2 6.44,42.93 R11.2 | C5.1 13.37,27.91 13.37,28.8 12.86,29.3 U1.14 10.03,29.72 v9.78,29.97
IOREF  (via drill 0.33)
  Top 0.203: v43.18,36.45 43.18,35.05 43.56,34.67 44.45,34.67 45.72,35.94 46.86,35.94 48.39,34.42 48.39,32.77 47.12,31.5 47.12,27.43 47.88,26.67 v53.09,26.67 | v56.01,26.67 55.75,26.42 55.75,26.04 57.4,24.38 57.4,17.27 57.15,17.02 57.15,14.1 57.4,13.84 57.4,12.83 57.15,12.57 57.15,10.54 v56.39,9.78 | J2.7 15.24,4.19 19.3,8.26 24.38,8.26 25.53,7.11 25.53,6.48 26.92,5.08 40.51,5.08 v40.77,5.46
  Bottom 0.203: R23.1 41.31,39.2 42.67,37.85 42.67,36.96 v43.18,36.45 | v53.09,26.67 53.34,26.92 54.48,26.92 54.74,26.67 v56.01,26.67 | v56.39,9.78 56.39,9.4 56.13,9.14 56.13,6.86 55.88,6.6 55.88,6.22 54.48,4.83 52.45,4.83 52.32,4.95 51.18,4.95 50.8,4.57 49.66,4.57 49.28,4.95 49.28,6.35 48.9,6.73 48.13,6.73 47.62,6.22 47.62,6.1 46.74,5.21 43.56,5.21 43.31,5.46 v40.77,5.46
LED_BUILTIN
  Bottom 0.203: U7.13 28.07,40.07 28.07,41.4 27.81,41.66 D2.K
MCU_!SS!  (via drill 0.33)
  Top 0.203: J3.8 22.48,50.8 22.61,50.67 22.61,50.16 23.24,49.53 24.51,49.53 25.15,50.16 | 25.15,50.8 25.15,50.16 | 25.15,50.16 25.91,49.4 28.7,49.4 29.21,48.9 51.44,48.9 v51.69,48.64 | v55.24,32.77 54.48,32.77 53.98,33.27 53.98,35.05 55.63,36.7 55.63,42.55 v55.88,42.8
  Bottom 0.203: v51.69,48.64 55.37,44.96 55.37,43.31 v55.88,42.8 | R36.1 55.24,32.6 v55.24,32.77 55.88,32.77 56.13,33.02 57.66,33.02 57.78,32.89 J12.7
MCU_MISO  (via drill 0.33)
  Top 0.203: v51.44,36.2 50.93,36.2 50.67,35.94 v49.15,35.94
  Bottom 0.203: J11.1 49.15,30.48 49.78,31.11 49.78,34.42 49.4,34.8 49.4,35.69 v49.15,35.94 49.02,36.07 49.02,37.08 48.9,37.21 47.24,37.21 46.61,37.85 U8.3 | J12.5 57.78,36.7 56.64,35.56 53.09,35.56 52.45,36.2 v51.44,36.2
MCU_MOSI  (via drill 0.33)
  Top 0.203: J11.4 52.58,29.59 v52.58,32
  Bottom 0.203: J12.6 R35.2 55.46,34.25 53.98,32.77 53.34,32.77 52.7,32.13 v52.58,32
MCU_SCK  (via drill 0.33)
  Top 0.203: J11.3 49.66,29.21 49.66,33.66 50.04,34.04 51.69,34.04 52.45,34.8 52.45,36.2 53.34,37.08 53.47,37.08 v53.85,37.47
  Bottom 0.203: J12.4 R31.1 55.59,38.95 54.1,37.47 v53.85,37.47
MGR_!RESET  (via drill 0.33)
  Top 0.203: v22.35,37.34 24.13,39.12 26.29,39.12 28.32,37.08 33.53,37.08 v33.66,36.96
  Bottom 0.203: 32.8,36.64 R26.1 32.68,35.56 | 32.8,36.64 D1.A 32.26,37.74 J9.5 | v22.35,37.34 22.1,37.08 22.1,35.05 21.46,34.42 21.28,34.42 U7.29 | 32.8,36.64 33.34,36.64 v33.66,36.96
MGR_!SS!  (via drill 0.33)
  Top 0.203: v28.96,40.01 28.96,40.26 30.86,42.16 30.86,43.05 31.62,43.81 35.43,43.81 37.34,41.91 37.34,41.27 38.23,40.39 40.26,40.39 41.78,38.86 v42.93,38.86 | v45.34,28.07 v42.29,28.07
  Bottom 0.203: U7.14 28.96,39.83 v28.96,40.01 | v42.93,38.86 42.93,38.48 43.31,38.1 43.31,37.59 44.96,35.94 44.96,35.18 44.7,34.92 44.7,32 43.94,31.24 43.94,29.46 v45.34,28.07 | v42.29,28.07 41.4,27.18 U3.9
MISO
  Bottom 0.203: U7.16 29.23,37.85 29.72,37.85 30.1,38.23 30.1,41.4 30.73,42.04 30.73,42.55 29.46,43.81 29.46,44.58 29.97,45.09 J9.1
MOSI  (via drill 0.33)
  Top 0.203: v29.21,38.73 32.77,38.73 33.53,39.5 33.53,41.27 J9.4
  Bottom 0.203: U7.15 28.99,38.73 v29.21,38.73
N$3  (via drill 0.33)
  Top 0.203: J2.6 16.64,2.54 16.51,2.67 16.51,4.57 19.56,7.62 24,7.62 24.89,6.86 24.89,6.22 26.54,4.45 41.02,4.45 41.66,5.08 41.66,6.1 v41.91,6.35
  Bottom 0.203: v41.91,6.35 42.8,6.35 43.05,6.6 43.05,7.24 43.69,7.87 43.69,9.02 43.18,9.53 43.18,11.18 42.55,11.81 42.55,22.23 42.67,22.35 U3.8
N$6  (via drill 0.33)
  Top 0.203: v51.31,35.05 48.64,35.05 48.01,35.69 v48.01,36.32 48.51,36.83 49.02,36.83 50.42,38.23 51.94,38.23 53.47,39.75 53.47,41.27 51.94,42.8 51.69,42.8 50.8,43.69 50.8,45.72 51.44,46.35 R34.2
  Bottom 0.203: R35.1 52.83,34.29 52.07,35.05 v51.31,35.05 | v48.01,36.32 47.75,36.07 46.1,36.07 45.34,36.83 U8.2
N$7  (via drill 0.33)
  Top 0.203: v28.96,45.97 28.07,45.97 27.81,45.72 v27.81,44.58
  Bottom 0.203: v28.96,45.97 29,45.97 R38.2 | v27.81,44.58 26.16,42.93 D2.A
N$8  (via drill 0.33)
  Top 0.203: v50.67,37.21 50.93,37.47 52.45,37.47 v52.83,37.85 54.1,39.12 54.1,41.78 52.24,43.65 R32.1
  Bottom 0.203: R31.2 53.63,39.2 53.59,38.61 v52.83,37.85 | U8.6 50.42,37.47 v50.67,37.21
N$10
  Bottom 0.203: U3.6 41.4,31.5 40.64,32.26 40.64,36.62 R23.2 40.26,37.25 R24.2
N$11
  Bottom 0.203: R25.2 47.24,6.6 48.47,7.83 Q3.3(D) 49.28,8.26 53.91,12.89 U6.3
N$12  (via drill 0.33)
  Top 0.203: R36.2 54.4,29.5 v55.37,30.48
  Bottom 0.203: U8.8 51.69,31.62 52.58,30.73 52.58,29.72 52.79,29.5 R36.2 54.4,29.5 v55.37,30.48
N$15
  Bottom 0.203: Q1.1(G) 43.24,46.67 42.99,46.93 42.32,46.93 R7.1
N$18  (via drill 0.33)
  Top 0.203: v47.62,47.24 41.15,47.24 40.01,46.1 40.01,43.43 38.48,41.91 38.48,41.66 v38.35,41.53 | v37.85,23.24 37.59,23.5 35.18,23.5 34.04,22.35 33.27,22.35 32.77,22.86 27.43,22.86 22.86,18.29 19.3,18.29 18.03,17.02 v15.88,17.02 | v36.07,32.38 v38.35,32.38
  Bottom 0.203: Q1.3(D) 46.44,47.84 47.03,47.84 v47.62,47.24 | v38.35,32.38 38.35,31.88 38.23,31.75 38.23,29.08 37.59,28.45 37.59,26.92 36.96,26.29 36.96,24.13 v37.85,23.24 | v38.35,41.53 37.97,41.15 37.97,38.61 37.47,38.1 37.47,34.16 36.32,33.02 36.32,32.64 v36.07,32.38 | R5.1 14.64,18.16 15.24,18.16 15.88,17.53 v15.88,17.02 15.88,14.35 16.45,13.78 U2.3
N$19
  Bottom 0.203: R20.1 31.15,6.22 R16.1 32,8.38 33.66,10.03 U4.1
N$20
  Bottom 0.203: U4.3 33.08,14.03 31.5,15.62 31.5,19.43 30.61,20.32 Q2.3(D) 24.85,20.32 R19.1
N$22
  Bottom 0.203: Q2.1(G) 27.24,21.27 25.95,22.57 R18.1
N$24
  Bottom 0.203: U5.4 20.04,7.9 C3.1
N$25
  Bottom 0.203: R22.2 57.62,10.41 57.02,10.41 56.77,10.67 53.34,10.67 53.09,10.41 52.2,10.41 50.55,8.76 50.55,6.73 50.23,6.41 Q3.1(G)
RPU_AREF
  Bottom 0.203: U7.20 27.81,32.57 27.81,32.26 C10.1 29.59,30.48 TP5.TP
RX  (via drill 0.33)
  Top 0.203: v49.53,47.24 49.15,47.24 48.26,46.35 47.24,46.35 46.99,46.61 41.4,46.61 40.64,45.85 40.64,43.18 39.5,42.04 v39.5,41.53
  Bottom 0.203: J4.3 48.26,49.28 49.53,48.01 v49.53,47.24 | R24.1 39.37,41.4 v39.5,41.53
RX_!RE  (via drill 0.33)
  Top 0.203: v16.64,38.23 16.38,38.23 16,37.85 16,35.69 15.75,35.43 15.75,34.92 15.24,34.42 15.24,34.04 16.38,32.89 16.38,31.62 16.89,31.11 16.89,30.35 16.26,29.72 16.26,29.21 15.11,28.07 15.11,25.4 13.72,24 v13.72,23.75 | v49.66,22.61 49.4,22.86 44.2,22.86 42.93,24.13 26.92,24.13 22.35,19.56 13.46,19.56 12.57,18.67 v12.06,18.67 | v49.66,20.57 49.66,19.56 49.91,19.3 49.91,17.65 50.55,17.02 50.55,14.61 51.44,13.72 52.45,13.72 v52.7,13.46
  Bottom 0.203: v52.7,13.46 53.4,14.16 U6.2 55.82,14.16 56.94,15.28 R21.1 | U7.2 18.25,38.73 16.89,38.73 16.64,38.48 v16.64,38.23 | v49.66,22.61 49.91,22.35 49.91,20.83 v49.66,20.57 | v12.06,18.67 12.32,18.92 12.32,20.7 11.94,21.08 11.94,21.72 13.72,23.5 v13.72,23.75
RX_DE  (via drill 0.33)
  Top 0.203: v43.43,20.57 v41.66,20.57 | v39.24,27.94 38.48,28.7 36.83,28.7 35.56,29.97 33.66,29.97 31.75,28.07 v21.34,28.07
  Bottom 0.203: R25.1 44.23,6.9 45.72,8.38 45.72,10.92 45.21,11.43 43.81,11.43 43.18,12.06 43.18,13.59 43.56,13.97 43.56,14.22 43.18,14.61 43.18,20.32 v43.43,20.57 | v41.66,20.57 41.66,20.83 41.91,21.08 41.91,23.5 41.66,23.75 41.02,23.75 40.77,24 40.77,26.42 v39.24,27.94 | U7.26 21.34,31.08 v21.34,28.07
RX_RPU  (via drill 0.33)
  Top 0.203: v55.12,27.56 55.12,25.78 56.39,24.51 v56.39,24.13 56.77,23.75 56.77,17.53 56.13,16.89 v56.13,16.26 | v45.59,29.97 45.34,29.84 41.91,29.84 41.15,29.08 v40.64,29.08
  Bottom 0.203: v40.64,29.08 40.13,29.59 U3.5 | v55.12,27.56 54.86,27.81 52.96,27.81 51.56,29.21 47.24,29.21 46.48,29.97 v45.59,29.97 | U6.1 55.31,15.43 v56.13,16.26 | R17.1 55.46,23.2 v56.39,24.13
SCK
  Bottom 0.203: U7.17 28.64,35.75 30.73,37.85 30.73,41.02 J9.3
SCL
  Bottom 0.203: R30.2 6.39,47.97 J3.1
SCL0  (via drill 0.33)
  Top 0.203: v12.19,44.7 15.75,44.7 16.64,43.81 16.64,42.42 16.13,41.78 16.13,39.75 14.73,38.35 14.73,36.7 13.97,35.94 13.97,34.42 15.75,32.64 15.75,30.99 v16,30.73
  Bottom 0.203: R30.1 10.83,46.35 R28.2 12.19,45.12 v12.19,44.7 | v16,30.73 16.38,30.35 18.35,30.35 U7.28
SCL1  (via drill 0.33)
  Top 0.203: v20.45,41.78 20.45,42.04 19.56,42.93 v18.29,42.93 | v15.11,43.18 14.73,42.93 14.73,41.78 12.83,39.88 12.83,37.59 11.81,36.58 11.81,33.91 13.84,31.88 13.84,25.91 12.06,24.13 J7.1
  Bottom 0.203: U7.6 20.45,41.07 v20.45,41.78 | v18.29,42.93 17.4,42.93 17.14,43.18 v15.11,43.18
SDA
  Bottom 0.203: J3.2 7.53,49.36 R29.2
SDA0  (via drill 0.33)
  Top 0.203: v10.92,49.02 11.18,48.77 11.18,44.32 11.68,43.81 12.95,43.81 13.21,44.07 15.49,44.07 16,43.56 16,42.55 15.49,42.04 15.49,40.01 14.99,39.5 14.48,39.5 14.1,39.12 14.1,37.08 13.21,36.2 13.21,34.29 15.11,32.38 15.11,29.84 v15.37,29.59
  Bottom 0.203: R29.1 10.92,48.26 | 10.92,48.26 R27.2 12.32,48.55 | v15.37,29.59 18.71,29.59 U7.27 | v10.92,49.02 10.92,48.26
SDA1  (via drill 0.33)
  Top 0.203: v14.61,40.39 14.22,40.39 13.46,39.62 13.46,37.34 12.57,36.45 12.57,34.04 14.48,32.13 14.48,25.65 12.32,23.5 6.86,23.5 5.49,22.13 J7.2
  Bottom 0.203: U7.3 18.75,39.37 16,39.37 14.99,40.39 v14.61,40.39
SHUTDWN  (via drill 0.33)
  Top 0.203: 26.16,44.07 24.77,44.07 23.37,42.67 22.61,42.67 20.83,40.89 17.4,40.89 16.76,40.26 16.76,39.5 15.37,38.1 15.37,36.2 14.86,35.69 v14.86,35.31 | 26.16,44.07 26.54,43.69 26.54,42.04 v26.29,41.78 | TP1.TP 27.18,47.24 26.42,46.48 26.42,44.32 26.16,44.07
  Bottom 0.203: U7.12 27.3,40.44 27.3,41.15 26.67,41.78 v26.29,41.78 | U1.11 13.84,33.53 14.86,34.54 v14.86,35.31
SPIREF
  Top 0.203: R37.2 53.59,31.96 53.59,32.51 52.51,33.59
  Top 0.406: J11.2 50.93,32.64 51.44,33.15 52.07,33.15 52.51,33.59 53.21,34.29 53.21,35.43 54.86,37.08 54.86,42.42 54.19,43.09 R32.2 54.19,44.87 53.55,45.51 R34.1 54.36,46.35 54.99,46.99 J12.1
TX  (via drill 0.33)
  Top 0.203: v38.35,46.23 38.82,45.76 R8.2 37.72,43.09 v37.72,42.8
  Bottom 0.203: J4.4 45.72,49.53 45.47,49.28 45.47,48.26 44.83,47.62 43.43,47.62 42.93,48.13 41.57,48.13 R7.2 38.99,46.86 v38.35,46.23 | U3.1 35.05,32.64 36.83,34.42 36.83,38.35 37.34,38.86 37.34,42.42 v37.72,42.8
TX_!RE  (via drill 0.33)
  Top 0.203: v20.95,24 20.32,24.64 v16.51,24.64
  Bottom 0.203: U7.25 22.35,30.96 22.35,25.65 20.95,24.26 v20.95,24 | U2.2 15.24,12.51 | 15.24,12.51 13.99,12.51 R4.2 | v16.51,24.64 16.51,24.38 15.49,23.37 15.49,22.73 15.11,22.35 15.11,22.1 13.72,20.7 13.72,17.78 15.24,16.26 15.24,12.51
TX_DE  (via drill 0.33)
  Top 0.203: v17.4,25.53 17.65,25.27 20.57,25.27 20.95,24.89 21.84,24.89 23.24,26.29 v23.24,26.54
  Bottom 0.203: v23.24,26.54 22.99,26.8 22.99,30.48 23.62,31.11 23.62,32 22.1,33.53 22.1,34.16 22.86,34.92 22.86,36.45 23.24,36.83 23.24,39.5 23.75,40.01 23.75,40.28 U7.9 | R5.2 15.11,20.83 15.75,21.46 15.75,22.1 16.13,22.48 16.13,23.11 16.76,23.75 17.02,23.75 17.4,24.13 v17.4,25.53
TX_RPU  (via drill 0.33)
  Top 0.203: v33.66,23.24 33.4,23.5 27.18,23.5 22.61,18.92 17.78,18.92 v16.89,18.03
  Bottom 0.203: U3.2 36.32,29.46 36.07,29.21 36.07,27.43 35.69,27.05 35.69,24 35.31,23.62 34.04,23.62 v33.66,23.24 | R6.2 17.14,18.03 | 17.14,18.03 U2.4 | v16.89,18.03 17.14,18.03
VCC  (via drill 0.33)
  Top 0.203: v50.93,42.29 51.56,42.29 52.7,41.15 52.7,40.01 51.69,38.99 50.16,38.99 48.77,37.59 46.35,37.59 44.32,35.56 v44.07,35.56
  Bottom 0.203: R33.1 42.08,44.45 J10.2 45.09,43.18 49.66,43.18 50.55,42.29 v50.93,42.29 | C13.1 42.93,32.89 43.4,33.37 U8.14 v44.07,35.56
XTAL1
  Bottom 0.203: U7.7 21.46,41.18 21.46,44.2 20.7,44.96 20.7,45.21 | 20.7,45.21 Y1.1 | C11.1 21.46,45.97 20.7,45.21
XTAL2
  Bottom 0.203: U7.8 22.23,41.55 22.23,44.32 23.11,45.21 | 23.11,45.21 Y1.2 | C12.1 22.86,45.47 23.11,45.21

### Text on the board
tPlace: 12 | SCL | SDA | NC | 0V | 13 | 11 | !SS! | 9 | 8 | 7 | 6 | 5 | 4 | 3 | 2 | SHUTDWN | TX | RX | SPIREF | MISO | +3V3 | MOSI | 0V | HOST / VCC | HOST_SHDN | NC | MNG / LED | SCK | SPI | HOST_!RTS | MOSI | UART | !RST | 0V | SCK | !CS | HOST_RX | 0V | MISO | SCK | MNG_ICSP | HOST / !DTR | DTR / TXD | FROM_MSTR | HOST_TX | MISO | HOST_VCC | MOSI | HOST_!DSR | HOST_!CTS | DTR / RXD | MISO | SPIREF | !CS | HOST_0V | MNG_AREF | SCK | NC | MOSI | +3V3 | MNG_I2C | !RESET | 0V | TO / SLV | SCL | MCU SPI | SDA | +3V3 | 14226^6 | RPUBUS.ORG | RPUadpt | 0V | 1-2 TX / 7-8 RX / 3-6 DTR / PAIRS 100Ω / TERMINATIONS / 4-5 0V | IOREF | !RESET | NC | 5V | 0V | ADC2 | ADC4 | ADC6 | VIN | 0V | ADC0 | ADC1 | ADC3 | ADC5 | ADC7 | 0V
bPlace: RPUadpt | RPUBUS.ORG